# Altium schematic sheet LEDs.SchDoc
size A4
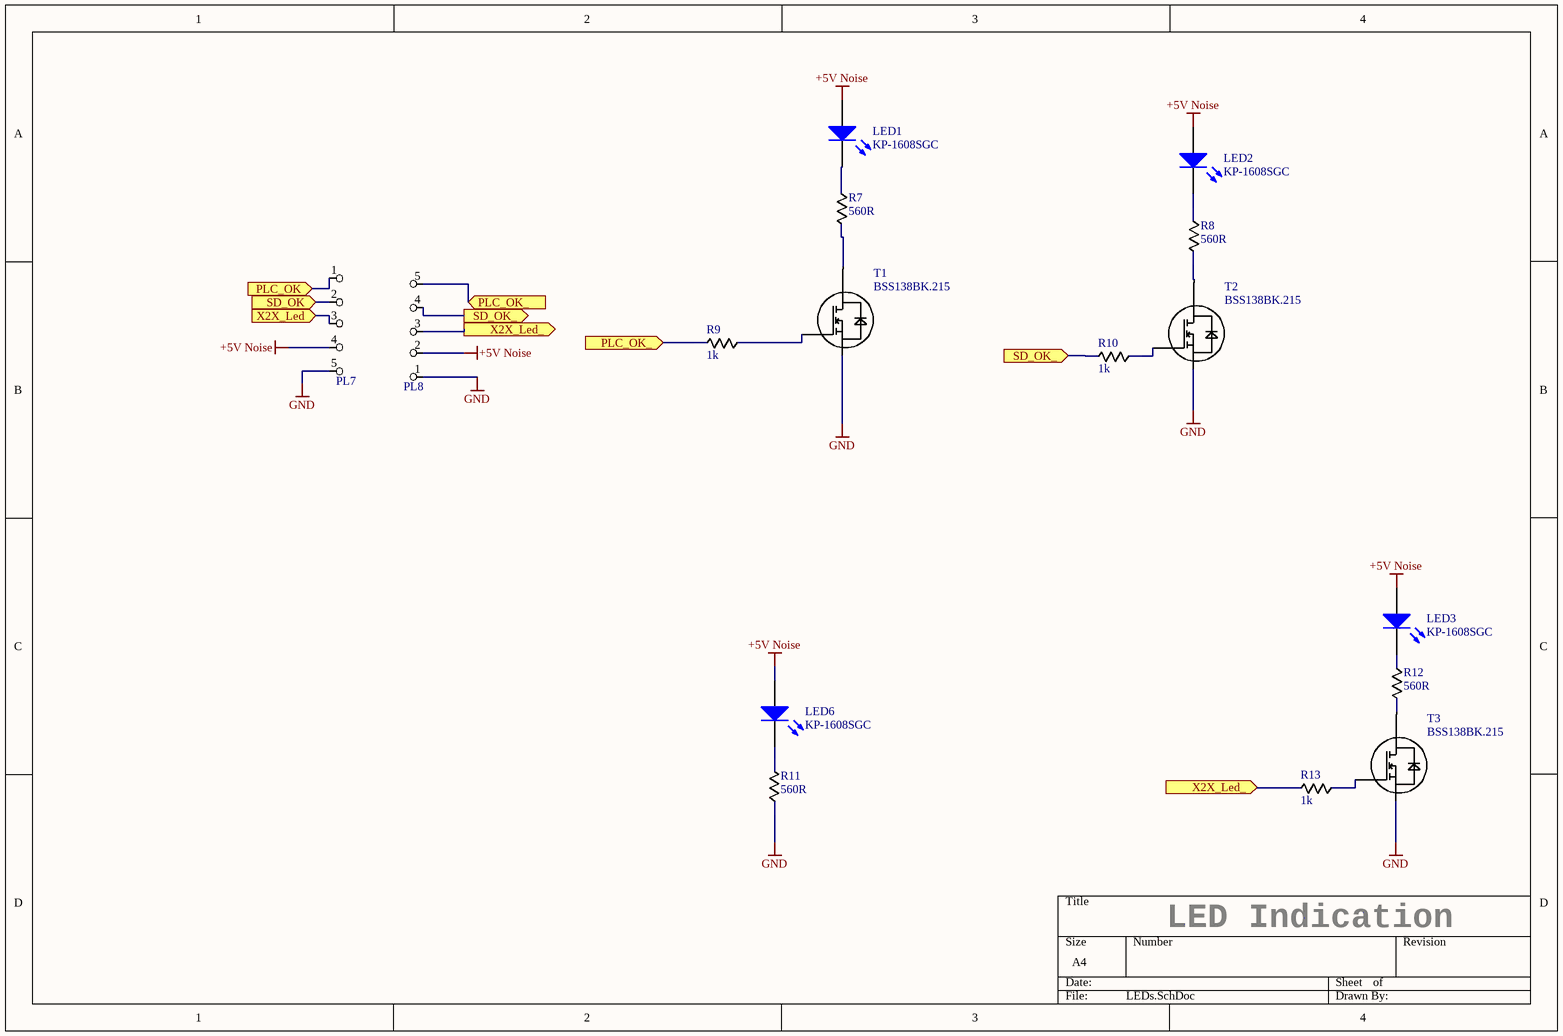
[diagram p0: LEDs.SchDoc]

## Parts
LED1  KP-1608SGC  [0603]
LED2  KP-1608SGC  [0603]
LED3  KP-1608SGC  [0603]
LED6  KP-1608SGC  [0603]
PL7  plug  [PLS 5]  (value not drawn)
PL8  plug  [PLS 5]  (value not drawn)
R7  560R  [0603]
R8  560R  [0603]
R9  1k  [0603]
R10  1k  [0603]
R11  560R  [0603]
R12  560R  [0603]
R13  1k  [0603]
T1  BSS138BK.215  [SOT23]
T2  BSS138BK.215  [SOT23]
T3  BSS138BK.215  [SOT23]

## Ports
PLC_OK, PLC_OK_, SD_OK, SD_OK_, X2X_Led, X2X_Led_

## Nets
+5V Noise: LED1.1(A) LED2.1(A) LED3.1(A) LED6.1(A) PL7.4 PL8.2
GND: PL7.5 PL8.1 R11.1 T1.2(S) T2.2(S) T3.2(S)
PLC_OK: PL7.1 ; port PLC_OK
PLC_OK_: PL8.5 R9.2 ; port PLC_OK_
SD_OK: PL7.2 ; port SD_OK
SD_OK_: PL8.4 R10.2 ; port SD_OK_
X2X_Led: PL7.3 ; port X2X_Led
X2X_Led_: PL8.3 R13.2 ; port X2X_Led_
NetLED1_2: LED1.2(K) R7.1
NetLED2_2: LED2.2(K) R8.1
NetLED3_2: LED3.2(K) R12.1
NetLED6_2: LED6.2(K) R11.2
NetR7_2: R7.2 T1.3(D)
NetR8_2: R8.2 T2.3(D)
NetR9_1: R9.1 T1.1(G)
NetR10_1: R10.1 T2.1(G)
NetR12_2: R12.2 T3.3(D)
NetR13_1: R13.1 T3.1(G)

## Notes on the sheet
- LED Indication

## Library data of the parts
LED1-LED3 LED6 = 0603 LED: Published: 8-Jun-2000; LatestRevisionDate: 08-Jul-2005; LatestRevisionNote: Mech Layer 1 removed.; PackageReference: LED-0; Publisher: Altium Limited; PackageDescription: LED; 2 Leads
PL7 PL8 = PLS-5R: PLS-5R (DS1022-1x5R)
R7 R8 R11 R12 = 0603 RES: RC0603JR-07560RL
R9 R10 R13 = 0603 RES: RC0603FR-071KL
T1-T3 = BSS138